# Altium schematic sheet IRComms.SchDoc
size A
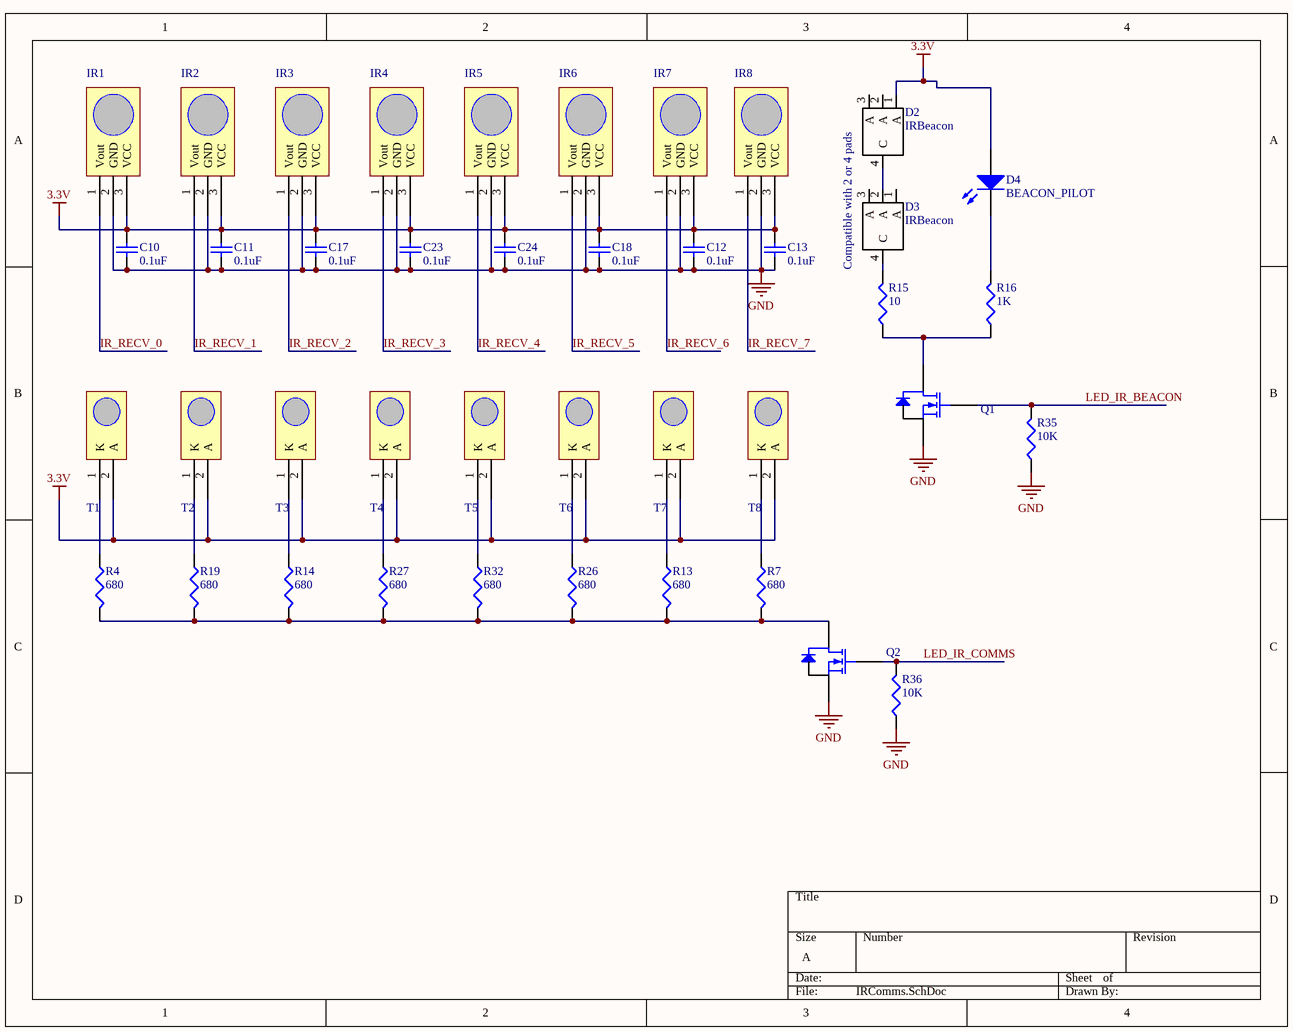
[diagram p0: IRComms.SchDoc]

## Parts
C10  value 0.1uF  [CAPC1005L]  (hidden comment: Cap Semi)
C11  value 0.1uF  [CAPC1005L]  (hidden comment: Cap Semi)
C12  value 0.1uF  [CAPC1005L]  (hidden comment: Cap Semi)
C13  value 0.1uF  [CAPC1005L]  (hidden comment: Cap Semi)
C17  value 0.1uF  [CAPC1005L]  (hidden comment: Cap Semi)
C18  value 0.1uF  [CAPC1005L]  (hidden comment: Cap Semi)
C23  value 0.1uF  [CAPC1005L]  (hidden comment: Cap Semi)
C24  value 0.1uF  [CAPC1005L]  (hidden comment: Cap Semi)
D2  IRBeacon  [IRBeacon]
D3  IRBeacon  [IRBeacon]
D4  BEACON_PILOT  [SurfaceMount(603)]
IR1  GP1UX31QS  [GP1UX31QS]  (value not drawn)
IR2  GP1UX31QS  [GP1UX31QS]  (value not drawn)
IR3  GP1UX31QS  [GP1UX31QS]  (value not drawn)
IR4  GP1UX31QS  [GP1UX31QS]  (value not drawn)
IR5  GP1UX31QS  [GP1UX31QS]  (value not drawn)
IR6  GP1UX31QS  [GP1UX31QS]  (value not drawn)
IR7  GP1UX31QS  [GP1UX31QS]  (value not drawn)
IR8  GP1UX31QS  [GP1UX31QS]  (value not drawn)
Q1  Mosfet  [SOT-23]  (value not drawn)
Q2  Mosfet  [SOT-23]  (value not drawn)
R4  value 680  [RESC1608L]  (hidden comment: Res3)
R7  value 680  [RESC1608L]  (hidden comment: Res3)
R13  value 680  [RESC1608L]  (hidden comment: Res3)
R14  value 680  [RESC1608L]  (hidden comment: Res3)
R15  value 10  [RESC1608L]  (hidden comment: Res3)
R16  value 1K  [RESC1608L]  (hidden comment: Res3)
R19  value 680  [RESC1608L]  (hidden comment: Res3)
R26  value 680  [RESC1608L]  (hidden comment: Res3)
R27  value 680  [RESC1608L]  (hidden comment: Res3)
R32  value 680  [RESC1608L]  (hidden comment: Res3)
R35  value 10K  [RESC1608L]  (hidden comment: Res3)
R36  value 10K  [RESC1608L]  (hidden comment: Res3)
T1  LN54  [LN54]  (value not drawn)
T2  LN54  [LN54]  (value not drawn)
T3  LN54  [LN54]  (value not drawn)
T4  LN54  [LN54]  (value not drawn)
T5  LN54  [LN54]  (value not drawn)
T6  LN54  [LN54]  (value not drawn)
T7  LN54  [LN54]  (value not drawn)
T8  LN54  [LN54]  (value not drawn)

## Nets
3.3V: C10.2 C11.2 C12.2 C13.2 C17.2 C18.2 C23.2 C24.2 D2.1(A) D4.1(A) IR1.3(VCC) IR2.3(VCC) IR3.3(VCC) IR4.3(VCC) IR5.3(VCC) IR6.3(VCC) IR7.3(VCC) IR8.3(VCC) T1.2(A) T2.2(A) T3.2(A) T4.2(A) T5.2(A) T6.2(A) T7.2(A) T8.2(A)
GND: C10.1 C11.1 C12.1 C13.1 C17.1 C18.1 C23.1 C24.1 IR1.2(GND) IR2.2(GND) IR3.2(GND) IR4.2(GND) IR5.2(GND) IR6.2(GND) IR7.2(GND) IR8.2(GND) Q1.2(S) Q2.2(S) R35.1 R36.1
IR_RECV_0: IR1.1(Vout)
IR_RECV_1: IR2.1(Vout)
IR_RECV_2: IR3.1(Vout)
IR_RECV_3: IR4.1(Vout)
IR_RECV_4: IR5.1(Vout)
IR_RECV_5: IR6.1(Vout)
IR_RECV_6: IR7.1(Vout)
IR_RECV_7: IR8.1(Vout)
LED_IR_BEACON: Q1.1(G) R35.2
LED_IR_COMMS: Q2.1(G) R36.2
NetD2_4: D2.4(C) D3.2(A)
NetD3_4: D3.4(C) R15.2
NetD4_2: D4.2(K) R16.2
NetQ1_3: Q1.3(D) R15.1 R16.1
NetQ2_3: Q2.3(D) R4.2 R7.2 R13.2 R14.2 R19.2 R26.2 R27.2 R32.2
NetR4_1: R4.1 T1.1(K)
NetR7_1: R7.1 T8.1(K)
NetR13_1: R13.1 T7.1(K)
NetR14_1: R14.1 T3.1(K)
NetR19_1: R19.1 T2.1(K)
NetR26_1: R26.1 T6.1(K)
NetR27_1: R27.1 T4.1(K)
NetR32_1: R32.1 T5.1(K)

Not connected (* = marked no-connect by the designer): D2 2(A) 3(A); D3 1(A) 3(A)

## Notes on the sheet
- Compatible with 2 or 4 pads

## Library data of the parts
C10-C13 C17 C18 C23 C24 = Cap Semi: Capacitor (Semiconductor SIM Model); Published: 8-Jun-2000; LatestRevisionDate: 29-May-2009; LatestRevisionNote: IPC-7351 Footprint Added.; PackageReference: C1206; Publisher: Altium Limited; PackageDescription: Chip Capacitor
D4 = LED
R4 R7 R13-R16 R19 R26 R27 R32 R35 R36 = Res3: Resistor; Published: 8-Jun-2000; LatestRevisionDate: 29-May-2009; LatestRevisionNote: IPC-7351 Footprint Added.; PackageReference: J1-0603; Publisher: Altium Limited; PackageDescription: Chip Resistor